# EAGLE design MotorController_ToniDove_Full (EAGLE 6.5.0)
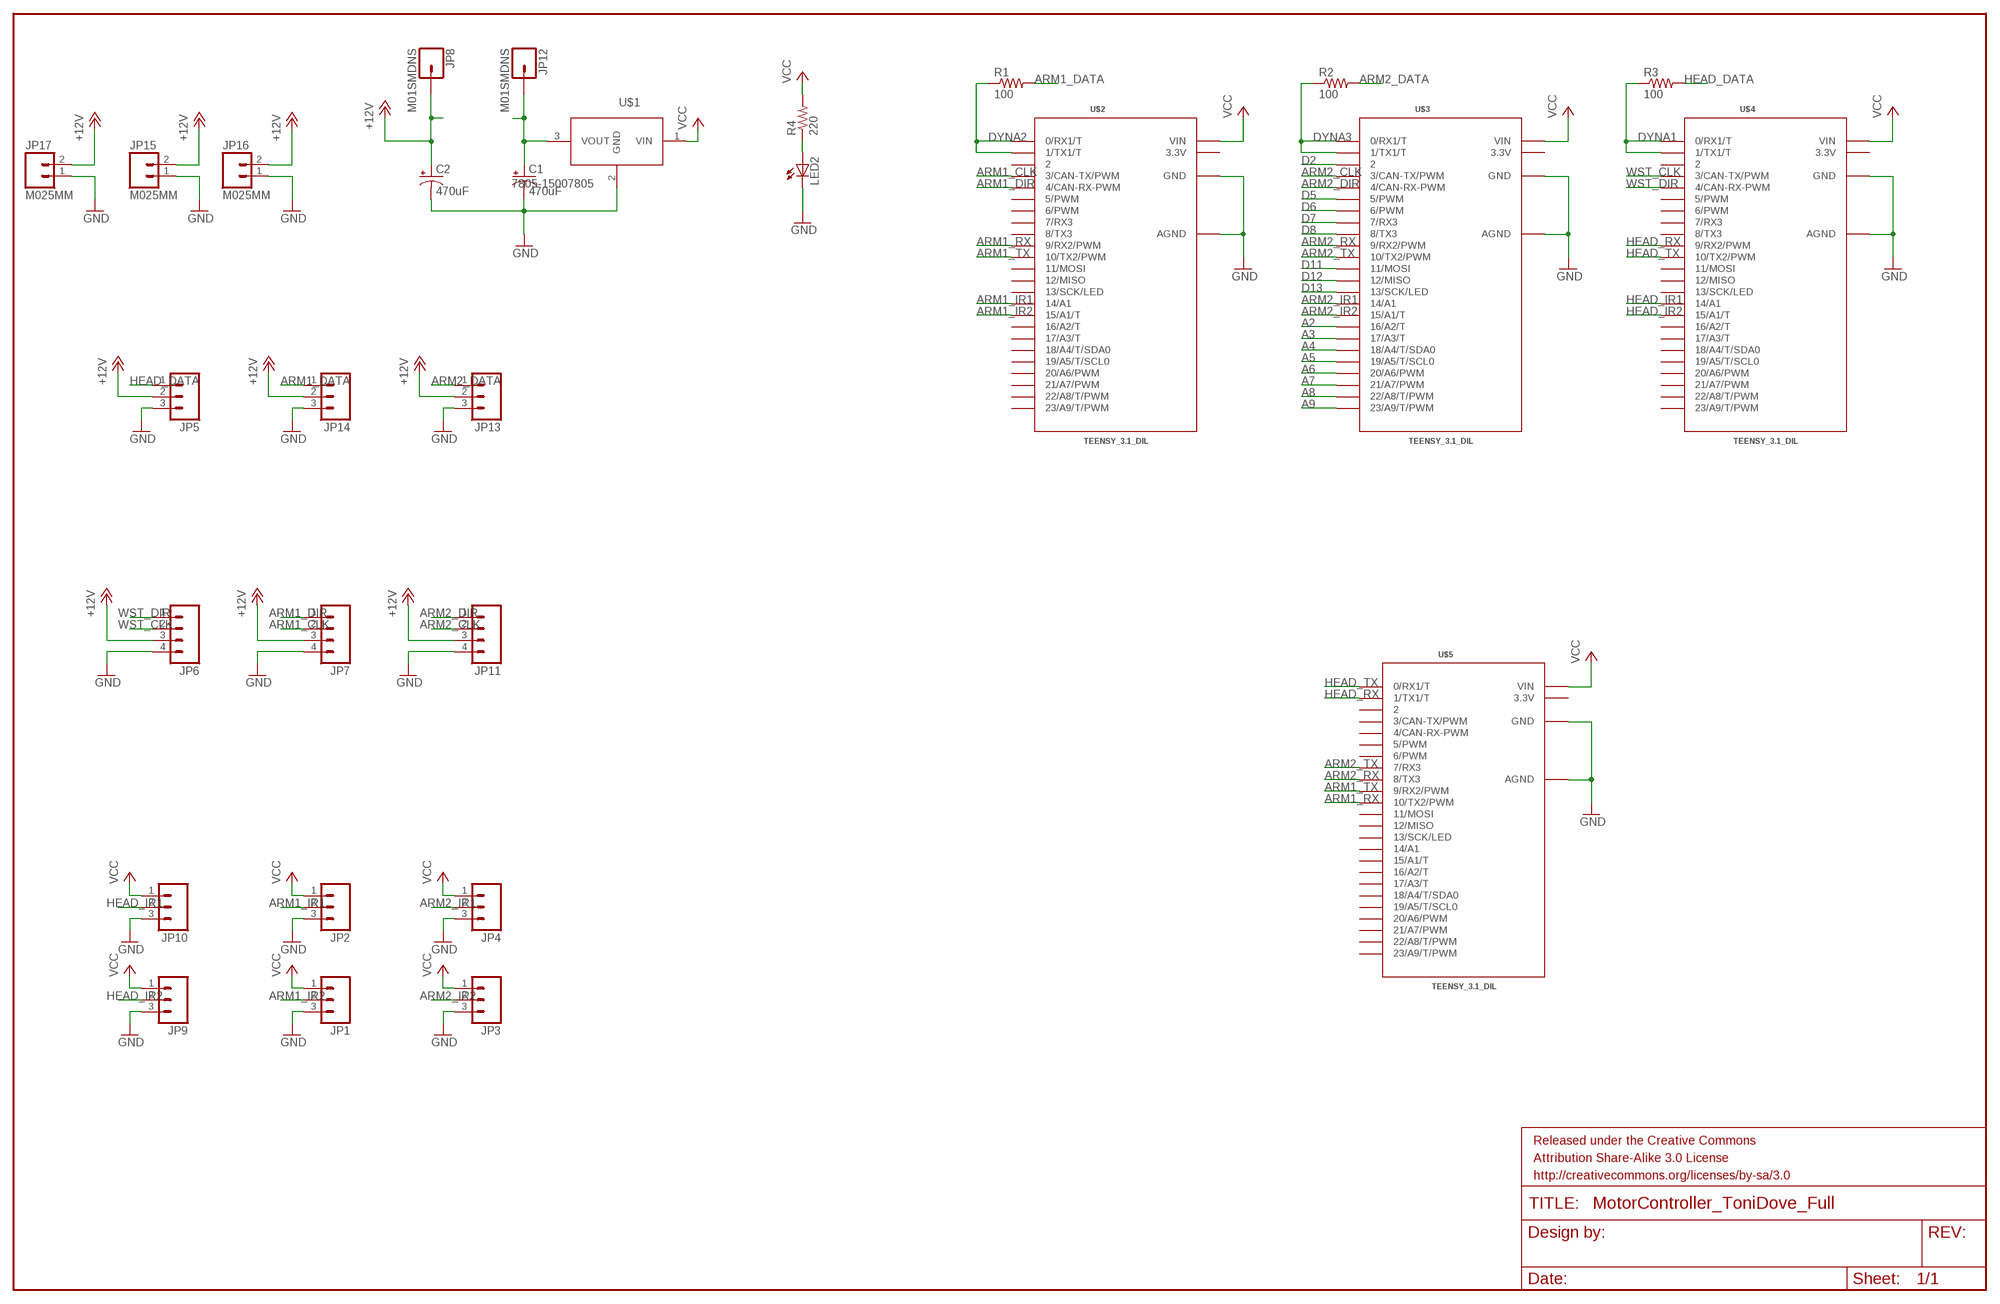
[diagram p0: schematic, sheet 1]

## Parts
C1  470uF  CPOL-USE5-13  [E5-13]
C2  470uF  CPOL-USE5-13  [E5-13]
FRAME1  FRAME-LEDGER  [CREATIVE_COMMONS]
JP1  M03PTH  [1X03]
JP2  M03PTH  [1X03]
JP3  M03PTH  [1X03]
JP4  M03PTH  [1X03]
JP5  M03PTH  [1X03]
JP6  M04SCREW  [SCREWTERMINAL-3.5MM-4]
JP7  M04SCREW  [SCREWTERMINAL-3.5MM-4]
JP8  M01SMDNS  [1X01NS]
JP9  M03PTH  [1X03]
JP10  M03PTH  [1X03]
JP11  M04SCREW  [SCREWTERMINAL-3.5MM-4]
JP12  M01SMDNS  [1X01NS]
JP13  M03PTH  [1X03]
JP14  M03PTH  [1X03]
JP15  M025MM  [SCREWTERMINAL-5MM-2]
JP16  M025MM  [SCREWTERMINAL-5MM-2]
JP17  M025MM  [SCREWTERMINAL-5MM-2]
LED2  LED5MM  [LED5MM]
R1  100  R-US_0204/7  [0204/7]
R2  100  R-US_0204/7  [0204/7]
R3  100  R-US_0204/7  [0204/7]
R4  220  R-US_0204/7  [0204/7]
U$1  7805-15007805  [UL94-V0]
U$2  TEENSY_3.1_DIL  [TEENSY3-DIL]
U$3  TEENSY_3.1_DIL  [TEENSY3-DIL]
U$4  TEENSY_3.1_DIL  [TEENSY3-DIL]
U$5  TEENSY_3.1_DIL  [TEENSY3-DIL]

## Nets
+12V: C2.+ JP5.2 JP6.3 JP7.3 JP8.1 JP11.3 JP13.2 JP14.2 JP15.2 JP16.2 JP17.2
A2: U$3.16/A2(16/A2/T)
A3: U$3.17/A3(17/A3/T)
A4: U$3.18/A4(18/A4/T/SDA0)
A5: U$3.19/A5(19/A5/T/SCL0)
A6: U$3.20/A6(20/A6/PWM)
A7: U$3.21/A7(21/A7/PWM)
A8: U$3.22/A8(22/A8/T/PWM)
A9: U$3.23/A9(23/A9/T/PWM)
ARM1_CLK: JP7.2 U$2.3(3/CAN-TX/PWM)
ARM1_DATA: JP14.1 R1.2
ARM1_DIR: JP7.1 U$2.4(4/CAN-RX-PWM)
ARM1_IR1: JP2.2 U$2.14/A0(14/A1)
ARM1_IR2: JP1.2 U$2.15/A1(15/A1/T)
ARM1_RX: U$2.9(9/RX2/PWM) U$5.10(10/TX2/PWM)
ARM1_TX: U$2.10(10/TX2/PWM) U$5.9(9/RX2/PWM)
ARM2_CLK: JP11.2 U$3.3(3/CAN-TX/PWM)
ARM2_DATA: JP13.1 R2.2
ARM2_DIR: JP11.1 U$3.4(4/CAN-RX-PWM)
ARM2_IR1: JP4.2 U$3.14/A0(14/A1)
ARM2_IR2: JP3.2 U$3.15/A1(15/A1/T)
ARM2_RX: U$3.9(9/RX2/PWM) U$5.8(8/TX3)
ARM2_TX: U$3.10(10/TX2/PWM) U$5.7(7/RX3)
D2: U$3.2
D5: U$3.5(5/PWM)
D6: U$3.6(6/PWM)
D7: U$3.7(7/RX3)
D8: U$3.8(8/TX3)
D11: U$3.11(11/MOSI)
D12: U$3.12(12/MISO)
D13: U$3.13(13/SCK/LED)
DYNA1: R3.1 U$4.0(0/RX1/T) U$4.1(1/TX1/T)
DYNA2: R1.1 U$2.0(0/RX1/T) U$2.1(1/TX1/T)
DYNA3: R2.1 U$3.0(0/RX1/T) U$3.1(1/TX1/T)
GND: C1.- C2.- JP1.3 JP2.3 JP3.3 JP4.3 JP5.3 JP6.4 JP7.4 JP9.3 JP10.3 JP11.4 JP13.3 JP14.3 JP15.1 JP16.1 JP17.1 LED2.K(C) U$1.2(GND) U$2.AGND U$2.GND U$3.AGND U$3.GND U$4.AGND U$4.GND U$5.AGND U$5.GND
HEAD_DATA: JP5.1 R3.2
HEAD_IR1: JP10.2 U$4.14/A0(14/A1)
HEAD_IR2: JP9.2 U$4.15/A1(15/A1/T)
HEAD_RX: U$4.9(9/RX2/PWM) U$5.1(1/TX1/T)
HEAD_TX: U$4.10(10/TX2/PWM) U$5.0(0/RX1/T)
N$2: LED2.A R4.1
N$6: C1.+ JP12.1 U$1.3(VOUT)
VCC: JP1.1 JP2.1 JP3.1 JP4.1 JP9.1 JP10.1 R4.2 U$1.1(VIN) U$2.VIN U$3.VIN U$4.VIN U$5.VIN
WST_CLK: JP6.2 U$4.3(3/CAN-TX/PWM)
WST_DIR: JP6.1 U$4.4(4/CAN-RX-PWM)
Unconnected: U$2.2 U$2.5(5/PWM) U$2.6(6/PWM) U$2.7(7/RX3) U$2.8(8/TX3) U$2.11(11/MOSI) U$2.12(12/MISO) U$2.13(13/SCK/LED) U$2.16/A2(16/A2/T) U$2.17/A3(17/A3/T) U$2.18/A4(18/A4/T/SDA0) U$2.19/A5(19/A5/T/SCL0) U$2.20/A6(20/A6/PWM) U$2.21/A7(21/A7/PWM) U$2.22/A8(22/A8/T/PWM) U$2.23/A9(23/A9/T/PWM) U$4.2 U$4.5(5/PWM) U$4.6(6/PWM) U$4.7(7/RX3) U$4.8(8/TX3) U$4.11(11/MOSI) U$4.12(12/MISO) U$4.13(13/SCK/LED) U$4.16/A2(16/A2/T) U$4.17/A3(17/A3/T) U$4.18/A4(18/A4/T/SDA0) U$4.19/A5(19/A5/T/SCL0) U$4.20/A6(20/A6/PWM) U$4.21/A7(21/A7/PWM) U$4.22/A8(22/A8/T/PWM) U$4.23/A9(23/A9/T/PWM) U$5.2 U$5.3(3/CAN-TX/PWM) U$5.4(4/CAN-RX-PWM) U$5.5(5/PWM) U$5.6(6/PWM) U$5.11(11/MOSI) U$5.12(12/MISO) U$5.13(13/SCK/LED) U$5.14/A0(14/A1) U$5.15/A1(15/A1/T) U$5.16/A2(16/A2/T) U$5.17/A3(17/A3/T) U$5.18/A4(18/A4/T/SDA0) U$5.19/A5(19/A5/T/SCL0) U$5.20/A6(20/A6/PWM) U$5.21/A7(21/A7/PWM) U$5.22/A8(22/A8/T/PWM) U$5.23/A9(23/A9/T/PWM)

## Power pins joined to a net without a drawn wire
3.3V: U$2.3.3V U$3.3.3V U$4.3.3V U$5.3.3V

## Library data of the parts
C1 C2 = rcl:CPOL-US: POLARIZED CAPACITOR, American symbol
FRAME1 = SparkFun-Aesthetics:FRAME-LEDGER: Schematic Frame Standard 11x14 US Ledger frame
JP1-JP5 JP9 JP10 JP13 JP14 = SparkFun-Connectors:M03: Header 3 Standard 3-pin 0.1" header. Use with straight break away headers (SKU : PRT-00116), right angle break away headers (PRT-00553), swiss pins (PRT-00743), machine pins (PRT-00117), and female headers (PRT-00115). Molex polarized connector foot print use with SKU : PRT-08232 with associated crimp pins and housings.
JP6 JP7 JP11 = SparkFun-Connectors:M04: Header 4 Standard 4-pin 0.1" header. Use with straight break away headers (SKU : PRT-00116), right angle break away headers (PRT-00553), swiss pins (PRT-00743), machine pins (PRT-00117), and female headers (PRT-00115). Molex polarized connector foot print use with SKU : PRT-08231 with associated crimp pins and housings. 1MM SMD Version SKU: PRT-10208
JP8 JP12 = SparkFun-Connectors:M01: Header 1 Standard 1-pin 0.1" header. Use with straight break away headers (SKU : PRT-00116), right angle break away headers (PRT-00553), swiss pins (PRT-00743), machine pins (PRT-00117), and female headers (PRT-00115).
JP15-JP17 = SparkFun-Connectors:M02: Standard 2-pin 0.1" header. Use with - straight break away headers ( PRT-00116) - right angle break away headers (PRT-00553) - swiss pins (PRT-00743) - machine pins (PRT-00117) - female headers (PRT-00115) Molex polarized connector foot print use with: PRT-08233 with associated crimp pins and housings. 2.54_SCREWTERM for use with PRT-10571. 3.5mm Screw Terminal footprints for PRT-08084 5mm Screw Terminal footprints for use with PRT-08433
LED2 = SparkFun-LED:LED: LEDs Standard schematic elements and footprints for 5mm, 3mm, 1206, and 0603 sized LEDs. 5mm - Spark Fun Electronics SKU : COM-00529 (and others)
R1-R4 = rcl:R-US_: RESISTOR, American symbol
U$1 = EzerLonginus:7805-1500
U$2-U$5 = Teensy_3_and_LC_Series_Boards_v1.1:TEENSY_3.1_DIL: Teensy 3.1 or 3.2 in a DIL Layout.

## Board
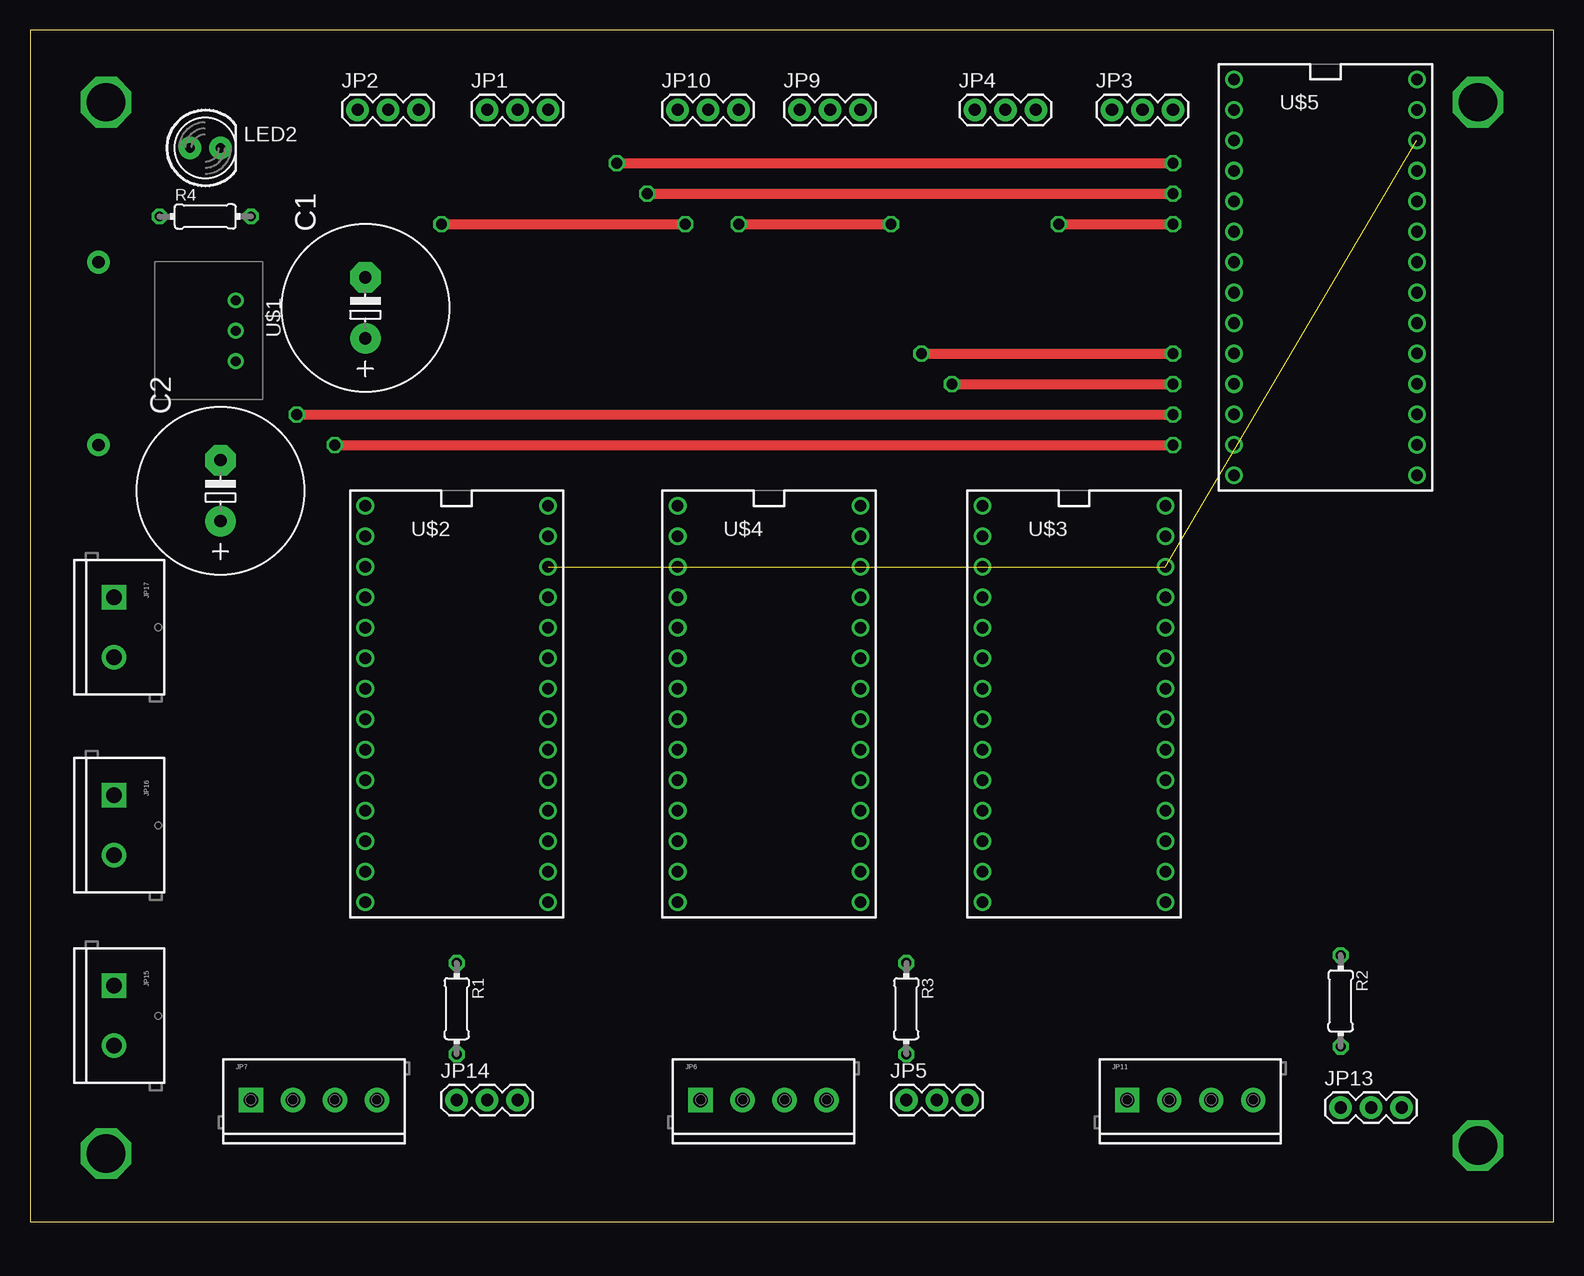
[diagram p1: board, top side]
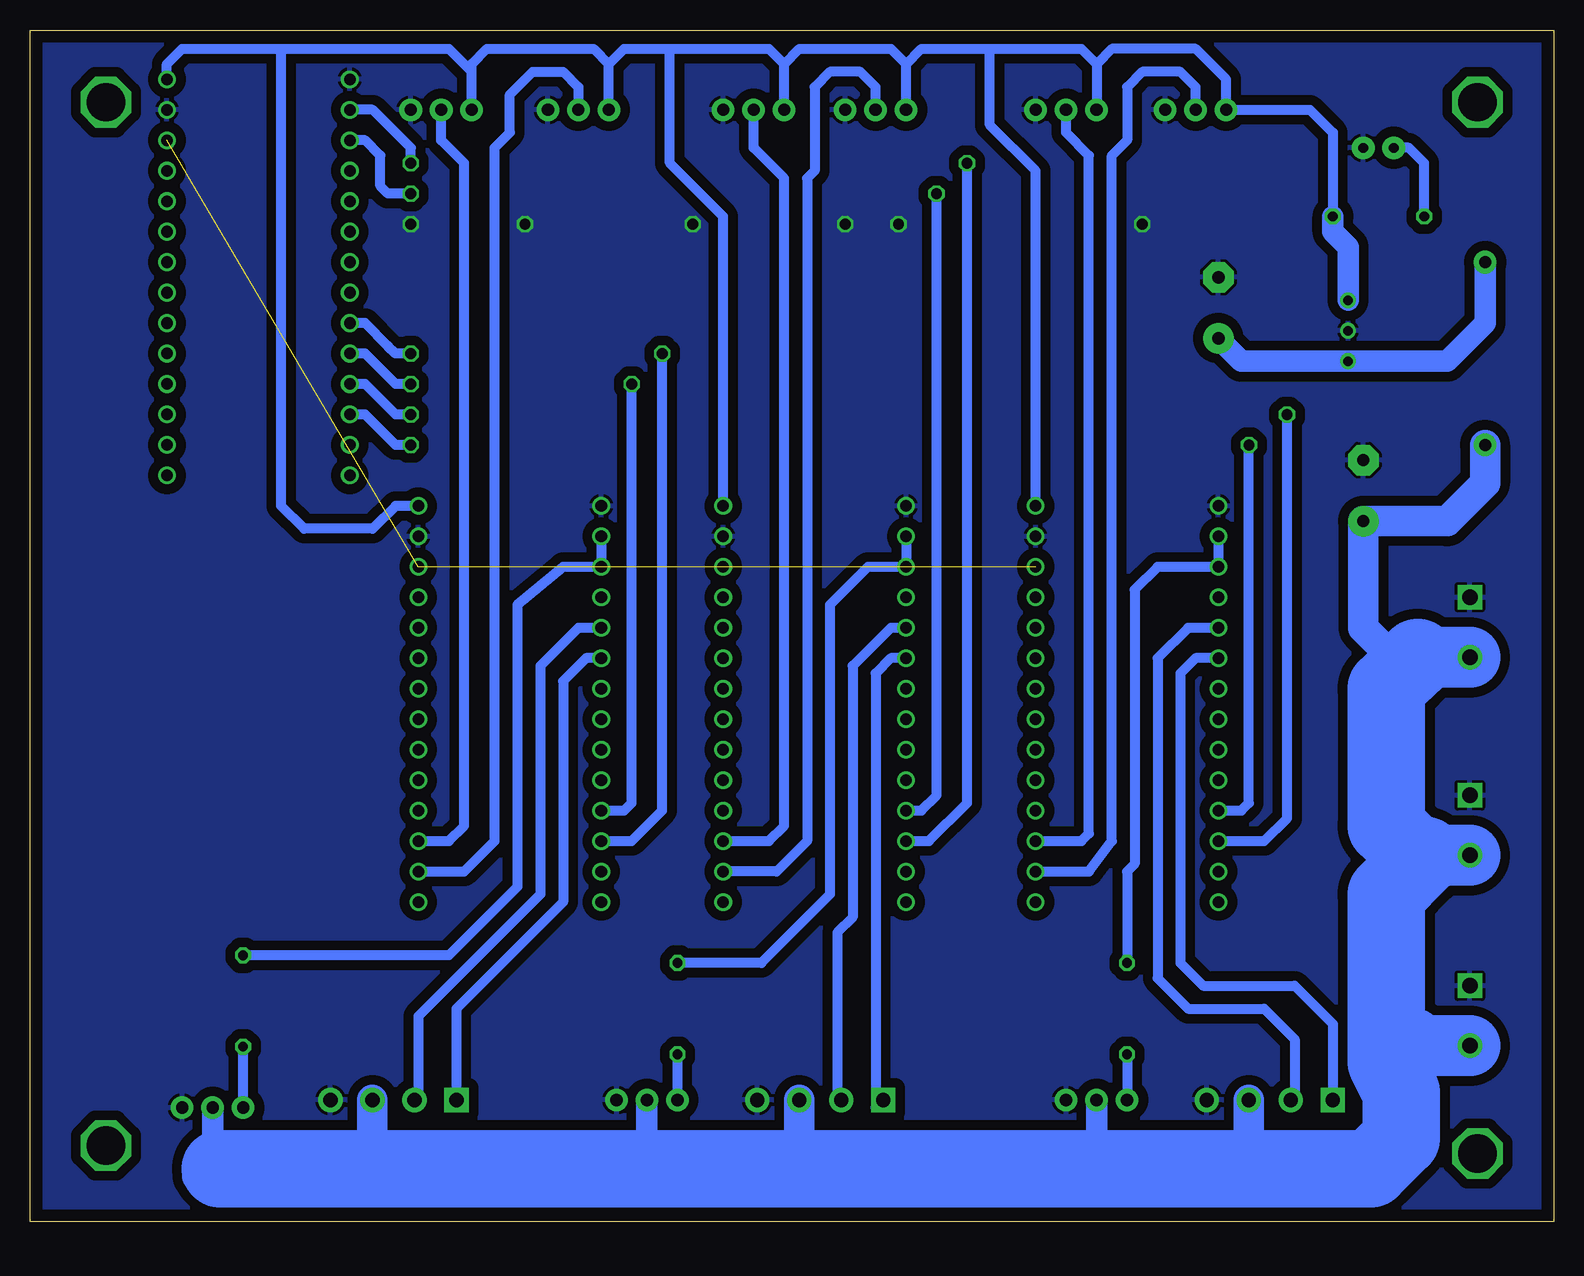
[diagram p2: board, bottom side, seen from below]

Size 126.98 x 99.36 mm. Coordinates in mm from the lower left corner, seen from the top.
Outline: 0,0 126.98,0 126.98,99.36 0,99.36 0,0
Copper layers (1*16): Top 0.035mm / dielectric 1.5mm / Bottom 0.035mm
Design rules "default": minimum track width 10mil, minimum drill 24mil, track to track 8mil, track to pad 8mil, pad to pad 8mil, via to via 8mil, smd to smd 8mil, copper to edge 40mil, drill to drill 8mil, minimum pad ring 10mil, minimum via ring 8mil, stop-mask expansion 4mil, vias tented up to drill 0mil, thermal gap 10mil

### Footprints (pad centres in the part's own frame; a part is rotated, then mirrored left to right if it is on the bottom)
E5-13 = drill 1.016 pad 2.54: + -2.54,0 | drill 1.016 pad 2.54 octagon: - 2.54,0
1X03 = drill 1.016 pad 1.88: 1 0,0; 2 2.54,0; 3 5.08,0
SCREWTERMINAL-3.5MM-4 = drill 1.2 pad 2.032 square: 1 0,0 | drill 1.2 pad 2.032: 2 3.5,0; 3 7,0; 4 10.5,0
1X01NS = drill 1.016 pad 1.88: 1 0,0
SCREWTERMINAL-5MM-2 = drill 1.3 pad 2.032 square: 1 0,0 | drill 1.3 pad 2.032: 2 5,0
LED5MM = drill 0.813 pad 1.88: A -1.27,0; K 1.27,0
0204/7 = drill 0.813 octagon: 1 -3.81,0; 2 3.81,0
UL94-V0 = drill 0.8: 1 -2.54,0; 2 0,0; 3 2.54,0
TEENSY3-DIL = drill 0.965: 0 -7.62,13.97; 1 -7.62,11.43; 2 -7.62,8.89; 3 -7.62,6.35; 3.3V 7.62,11.43; 4 -7.62,3.81; 5 -7.62,1.27; 6 -7.62,-1.27; 7 -7.62,-3.81; 8 -7.62,-6.35; 9 -7.62,-8.89; 10 -7.62,-11.43; 11 -7.62,-13.97; 12 -7.62,-16.51; 13 7.62,-16.51; 14/A0 7.62,-13.97; 15/A1 7.62,-11.43; 16/A2 7.62,-8.89; 17/A3 7.62,-6.35; 18/A4 7.62,-3.81; 19/A5 7.62,-1.27; 20/A6 7.62,1.27; 21/A7 7.62,3.81; 22/A8 7.62,6.35; 23/A9 7.62,8.89; AGND 7.62,13.97; GND -7.62,16.51; VIN 7.62,16.51

### Placement (x,y rotation side)
C1  27.94,76.2 90 top
C2  15.88,60.96 90 top
FRAME1  1.91,-15.88 0 top  (outside the outline)
JP1  38.1,92.71 0 top
JP2  27.3,92.71 0 top
JP3  90.17,92.71 0 top
JP4  78.74,92.71 0 top
JP5  73.03,10.16 0 top
JP6  55.88,10.16 0 top
JP7  18.41,10.16 0 top
JP8  5.71,64.77 0 top
JP9  64.14,92.71 0 top
JP10  53.98,92.71 0 top
JP11  91.44,10.16 0 top
JP12  5.71,80.01 0 top
JP13  109.22,9.53 0 top
JP14  35.56,10.16 0 top
JP15  6.99,19.68 270 top
JP16  6.99,35.56 270 top
JP17  6.99,52.07 270 top
LED2  14.61,89.53 0 top
R1  35.56,17.78 270 top
R2  109.22,18.41 270 top
R3  73.03,17.78 270 top
R4  14.61,83.82 0 top
U$1  17.14,74.3 270 top
U$2  35.56,43.18 0 top
U$3  87,43.18 0 top
U$4  61.59,43.18 0 top
U$5  107.95,78.74 0 top

### Tracks (layer width: path | path; a pad name or v marks a point on that pad's centre or on a via)
3.3V  (3 unrouted)
+12V
  Bottom 1.778: 76.2,2.54 75.56,4.45 JP5.2 | JP13.2 111.76,2.54 111.12,2.54 | JP14.2 38.1,3.81 37.47,4.45 | 25.41,2.56 24.78,2.56 24.77,2.54 25.4,2.54 | JP6.3 62.88,3.19 63.5,4.45 | 98.44,3.19 98.42,4.45
  Bottom 2.54: JP7.3 25.41,4.45 25.41,2.56 25.4,2.54 | JP11.3 98.44,3.19 98.44,2.56 98.42,2.54 | JP6.3 62.88,2.56 62.87,2.54 | 12.38,46.04 15.88,49.53 C2.+ 8.89,58.42 5.71,61.59 JP8.1 | 111.12,4.45 111.12,3.17 110.49,3.81 113.03,3.81 111.76,2.54
  Bottom 5.08: JP15.2 11.98,14.69 | JP16.2 10.71,30.56 | JP17.2 11.35,47.07
  Bottom 6.452: 11.98,14.69 13.97,13.34 | 13.97,13.34 12.7,10.79 12.7,6.99 15.24,4.45 25.41,4.45 37.47,4.45 63.5,4.45 75.56,4.45 98.42,4.45 111.12,4.45 | 10.71,30.56 11.11,30.16 | 11.11,30.16 13.97,27.3 13.97,13.34 | 11.35,47.07 12.38,46.04 13.97,44.45 13.97,33.02 11.11,30.16
ARM1_CLK
  Bottom 0.813: U$2.3 30.48,49.53 33.02,46.99 33.02,20.32 30.48,17.78 24.13,17.78 21.59,15.24 21.59,10.48 JP7.2
ARM1_DATA
  Bottom 0.813: R1.2 JP14.1
ARM1_DIR
  Bottom 0.813: U$2.4 29.84,46.99 31.11,45.72 31.11,21.59 29.21,19.68 21.59,19.68 18.41,16.51 JP7.1
ARM1_IR1
  Bottom 0.813: U$2.14/A0 38.73,29.21 36.83,31.75 36.83,88.9 35.56,90.17 35.56,94.61 34.29,95.89 31.11,95.89 29.84,94.61 JP2.2
ARM1_IR2
  Bottom 0.813: U$2.15/A1 39.37,31.75 38.73,32.38 38.73,88.9 40.64,90.81 JP1.2
ARM1_RX  (via drill 0.9)
  Top 0.813: v25.4,64.77 v95.25,64.77
  Bottom 0.813: U$2.9 26.04,34.29 25.4,34.92 v25.4,64.77 | v95.25,64.77 96.52,64.77 99.06,67.31 U$5.10
ARM1_TX  (via drill 0.9)
  Top 0.813: v22.23,67.31 v95.25,67.31
  Bottom 0.813: U$2.10 24.13,31.75 22.23,33.66 v22.23,67.31 | v95.25,67.31 96.52,67.31 99.06,69.85 U$5.9
ARM2_CLK
  Bottom 0.813: U$3.3 81.28,49.53 84.45,46.35 84.45,27.3 94.61,17.14 94.61,10.48 JP11.2
ARM2_DATA
  Bottom 0.813: JP13.1 R2.2
ARM2_DIR
  Bottom 0.813: U$3.4 80.64,46.99 82.55,45.09 82.55,26.67 91.44,17.78 JP11.1
ARM2_IR1
  Bottom 0.813: U$3.14/A0 90.81,29.21 88.27,31.75 88.27,89.53 87,90.81 87,93.98 85.09,95.89 82.55,95.89 81.28,94.61 JP4.2
ARM2_IR2
  Bottom 0.813: U$3.15/A1 92.08,31.75 90.81,33.02 90.81,88.27 92.71,90.17 JP3.2
ARM2_RX  (via drill 0.9)
  Top 0.813: v76.83,69.85 v95.25,69.85
  Bottom 0.813: U$3.9 77.47,34.29 76.83,34.92 v76.83,69.85 | v95.25,69.85 96.52,69.85 99.06,72.39 U$5.8
ARM2_TX  (via drill 0.9)
  Top 0.813: v74.3,72.39 v95.25,72.39
  Bottom 0.813: U$3.10 76.83,31.75 74.3,34.29 v74.3,72.39 | v95.25,72.39 96.52,72.39 97.16,73.03 99.06,74.93 U$5.7
DYNA1
  Bottom 0.813: U$4.0 U$4.1 57.15,54.61 60.33,51.44 60.33,27.3 66.04,21.59 R3.1
DYNA2
  Bottom 0.813: U$2.0 U$2.1 33.02,54.61 34.92,52.7 34.92,29.84 35.56,29.21 R1.1
DYNA3
  Bottom 0.813: U$3.0 U$3.1 82.55,54.61 86.36,51.44 86.36,27.94 92.08,22.23 R2.1
GND  (via drill 0.9)
  Top 0.813: v34.29,83.19 v54.61,83.19 | v85.72,83.19 v95.25,83.19 | v59.05,83.19 v71.75,83.19
  pour Bottom (isolate 0.813): -0.64,99.06 127.64,99.06 127,-0.64 -0.64,0
HEAD_DATA
  Bottom 0.813: R3.2 JP5.1
HEAD_IR1
  Bottom 0.813: JP10.2 56.52,94.61 57.78,95.89 60.33,95.89 61.59,94.61 61.59,87.63 62.23,87 62.23,31.75 64.77,29.21 U$4.14/A0
HEAD_IR2
  Bottom 0.813: U$4.15/A1 65.41,31.75 64.14,33.02 64.14,87 66.67,89.53 JP9.2
HEAD_RX  (via drill 0.9)
  Top 0.813: v51.44,85.72 v95.25,85.72
  Bottom 0.813: U$4.9 52.7,34.29 51.44,35.56 v51.44,85.72 | v95.25,85.72 97.16,85.72 97.79,86.36 97.79,88.9 99.06,90.17 U$5.1
HEAD_TX  (via drill 0.9)
  Top 0.813: v48.9,88.27 v95.25,88.27
  Bottom 0.813: U$4.10 52.07,31.75 48.9,34.92 v48.9,88.27 | v95.25,88.27 95.25,89.53 98.42,92.71 U$5.0
N$1  (via drill 3.2)
  other vias: 6.35,93.34
N$2
  Bottom 0.813: R4.1 10.79,88.27 12.06,89.53 LED2.A
N$3  (via drill 3.2)
  other vias: 6.35,5.71
N$4  (via drill 3.2)
  other vias: 120.65,93.34
N$5  (via drill 3.2)
  other vias: 120.65,6.35
N$6
  Bottom 1.778: JP12.1 5.71,74.93 8.89,71.75 U$1.3 26.04,71.75 C1.+
VCC
  Bottom 0.813: R4.2 18.41,90.81 20.32,92.71 JP2.1 27.3,95.25 29.84,97.79 36.83,97.79 38.1,96.52 | 38.1,96.52 JP1.1 | JP10.1 53.98,96.52 | 53.98,96.52 52.7,97.79 46.99,97.79 | 46.99,97.79 39.37,97.79 38.1,96.52 | U$2.VIN 43.18,87.63 46.99,91.44 46.99,97.79 | JP9.1 64.14,96.52 | 64.14,96.52 62.87,97.79 55.24,97.79 53.98,96.52 | JP4.1 78.74,96.52 | 78.74,96.52 77.47,97.79 73.66,97.79 | 73.66,97.79 65.41,97.79 64.14,96.52 | JP3.1 90.17,95.89 | 90.17,95.89 90.17,96.52 88.9,97.79 80.01,97.79 78.74,96.52 | U$5.VIN 115.57,96.52 114.3,97.79 106.05,97.79 | 106.05,97.79 92.08,97.79 90.17,95.89 | U$4.VIN 69.22,83.82 73.66,88.27 73.66,97.79 | U$3.VIN 96.52,59.69 98.42,57.78 104.14,57.78 106.05,59.69 106.05,97.79
  Bottom 1.778: U$1.1 17.14,81.28 18.41,82.55 R4.2
WST_CLK
  Bottom 0.813: U$4.3 55.24,49.53 58.42,46.35 58.42,25.4 59.69,24.13 59.69,10.47 JP6.2
WST_DIR
  Bottom 0.813: U$4.4 55.24,46.99 56.52,45.72 56.52,9.53 JP6.1